# Altium project HV Interface.PrjPcb (part 1 of 2)
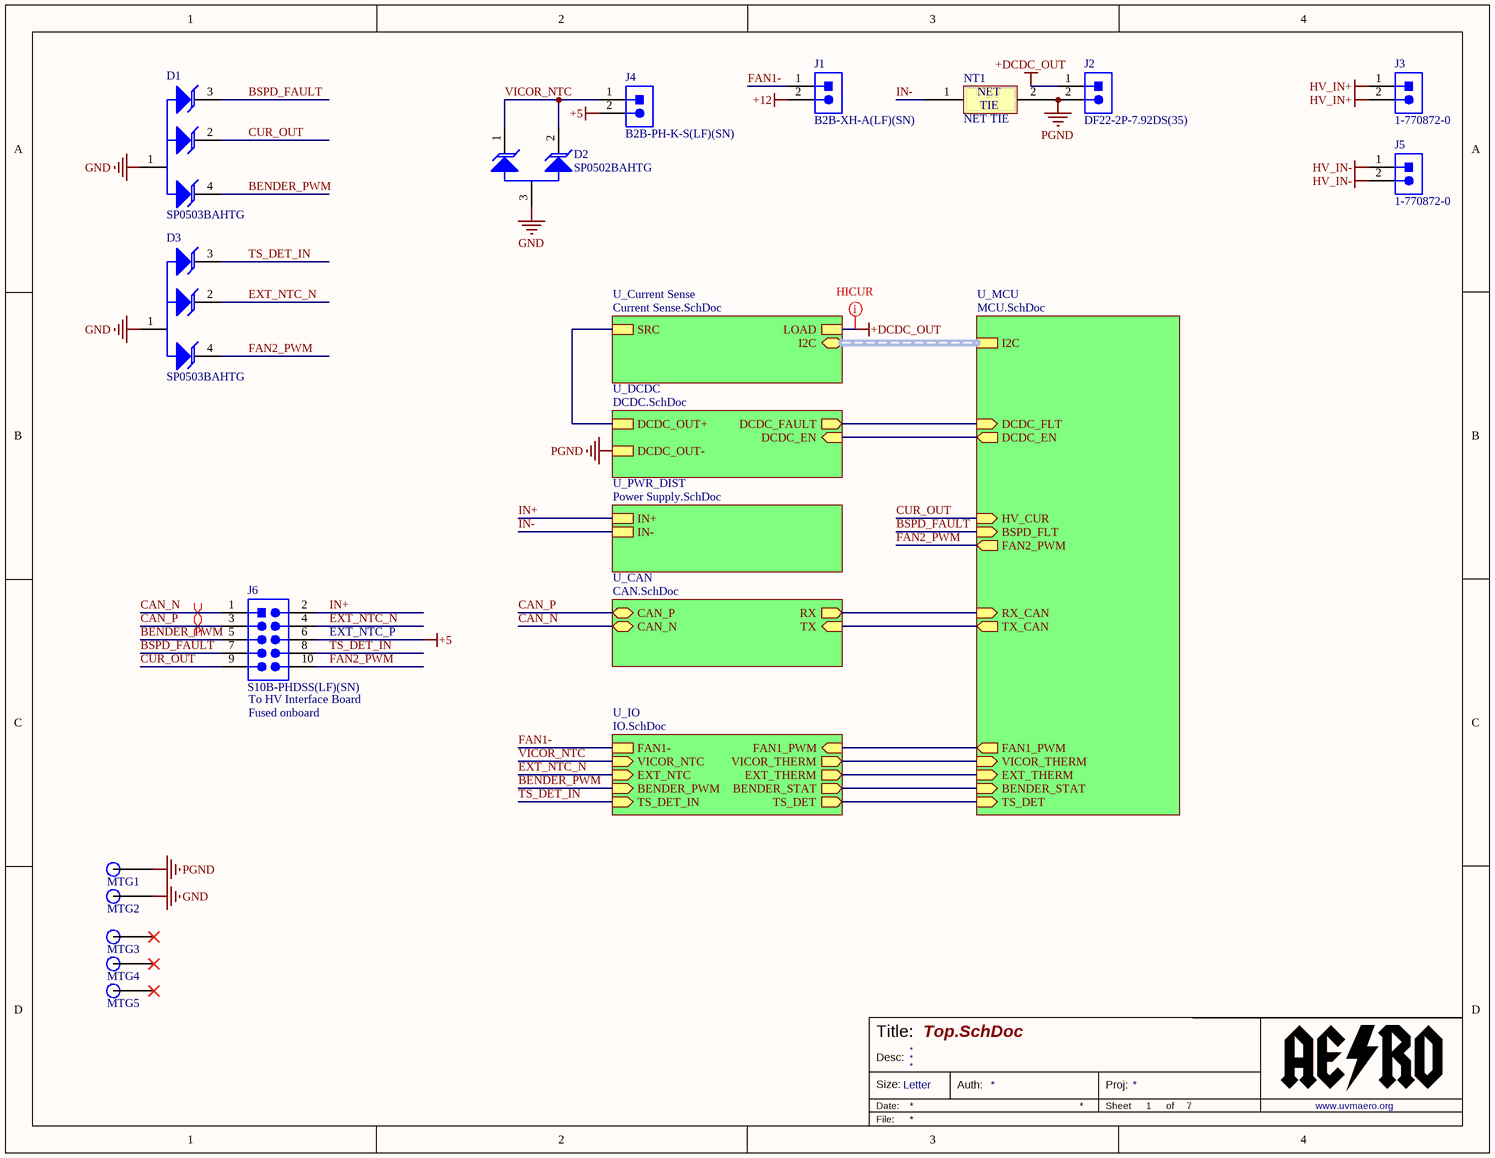
[diagram p0: Top.SchDoc]
ProjAuth: Andrew Katz; ProjName: CS4.5 HV Interface
7 sheets, 141 parts. Net scope: hierarchical (ports join the sheet entries above them; power ports are global).
Board file: HV Interface.PcbDoc
Sheets:
  Top.SchDoc
    U_DCDC = DCDC.SchDoc
    U_CAN = CAN.SchDoc
    U_MCU = MCU.SchDoc
    U_PWR_DIST = Power Supply.SchDoc
    U_IO = IO.SchDoc
    U_Current Sense = Current Sense.SchDoc

## Sheet Top.SchDoc
size Letter; DocumentNumber: 1; SheetNumber: 1; SheetTotal: 7

### Parts
D1  SP0503BAHTG  [Littelfuse_SP0503BAHTG_0]
D2  SP0502BAHTG  [TO-236 SOT23]
D3  SP0503BAHTG  [Littelfuse_SP0503BAHTG_0]
J1  B2B-XH-A(LF)(SN)  [B2B-XH-A(LF)(SN)]
J2  DF22-2P-7.92DS(35)  [CON2-1X2_RZ_DF22]
J3  1-770872-0  [CON2_1X2_P163_VM]
J4  B2B-PH-K-S(LF)(SN)  [JST_Sales_America_Inc._B2B-PH-K-S_LF_SN_0]
J5  1-770872-0  [CON2_1X2_P163_VM]
J6  S10B-PHDSS(LF)(SN)  [S10B-PHDSS]
MTG1  PCB MTG M3  [MTG-M3]  (value not drawn)  (no BOM)
MTG2  PCB MTG M3  [MTG-M3]  (value not drawn)  (no BOM)
MTG3  PCB MTG M3 HV  [MTG-M3-HV]  (value not drawn)  (no BOM)
MTG4  PCB MTG M3 HV  [MTG-M3-HV]  (value not drawn)  (no BOM)
MTG5  PCB MTG M3 HV  [MTG-M3-HV]  (value not drawn)  (no BOM)
NT1  NET TIE  [60MIL_TIE]  (net tie, no BOM)

### Sub-sheets
U_CAN = CAN.SchDoc: CAN_P (bidir), CAN_N (bidir), RX (out), TX (in)
U_Current Sense = Current Sense.SchDoc: I2C (bidir, harness I2C), SRC, LOAD
U_DCDC = DCDC.SchDoc: DCDC_FAULT (out), DCDC_EN (in), DCDC_OUT+, DCDC_OUT-
U_IO = IO.SchDoc: VICOR_THERM (out), EXT_THERM (out), FAN1-, FAN1_PWM (in), BENDER_PWM (in), BENDER_STAT (out), VICOR_NTC (in), EXT_NTC (in), TS_DET (out), TS_DET_IN (in)
U_MCU = MCU.SchDoc: I2C (harness I2C), HV_CUR (in), VICOR_THERM (in), DCDC_EN (out), EXT_THERM (in), FAN2_PWM (out), FAN1_PWM (out), RX_CAN (in), TX_CAN (out), DCDC_FLT (in), BSPD_FLT (in), BENDER_STAT (in), TS_DET (in)
U_PWR_DIST = Power Supply.SchDoc: IN+, IN-

### Nets
+5: J4.2 J6.6
+12: J1.2
+DCDC_OUT: J2.1 ; sheet U_Current Sense/LOAD
GND: D1.1 D2.3 D3.1 MTG2.1
HV_IN+: J3.1 J3.2
HV_IN-: J5.1 J5.2
PGND: J2.2 MTG1.1 NT1.2 ; sheet U_DCDC/DCDC_OUT-
BENDER_PWM: D1.4 J6.5 ; sheet U_IO/BENDER_PWM
BENDER_STAT: sheet U_MCU/BENDER_STAT, sheet U_IO/BENDER_STAT
BSPD_FAULT: D1.3 J6.7 ; sheet U_MCU/BSPD_FLT
CAN_N: J6.1 ; sheet U_CAN/CAN_N
CAN_P: J6.3 ; sheet U_CAN/CAN_P
CUR_OUT: D1.2 J6.9 ; sheet U_MCU/HV_CUR
DCDC_EN: sheet U_DCDC/DCDC_EN, sheet U_MCU/DCDC_EN
DCDC_FLT: sheet U_DCDC/DCDC_FAULT, sheet U_MCU/DCDC_FLT
DCDC_OUT+: sheet U_DCDC/DCDC_OUT+, sheet U_Current Sense/SRC
EXT_NTC_N: D3.2 J6.4 ; sheet U_MCU/EXT_THERM, sheet U_IO/EXT_THERM, sheet U_IO/EXT_NTC
FAN1-: J1.1 ; sheet U_IO/FAN1-
FAN1_PWM: sheet U_MCU/FAN1_PWM, sheet U_IO/FAN1_PWM
FAN2_PWM: D3.4 J6.10 ; sheet U_MCU/FAN2_PWM
IN+: J6.2 ; sheet U_PWR_DIST/IN+
IN-: NT1.1 ; sheet U_PWR_DIST/IN-
RX: sheet U_CAN/RX, sheet U_MCU/RX_CAN
TS_DET: sheet U_MCU/TS_DET, sheet U_IO/TS_DET
TS_DET_IN: D3.3 J6.8 ; sheet U_IO/TS_DET_IN
TX: sheet U_CAN/TX, sheet U_MCU/TX_CAN
VICOR_NTC: D2.1 D2.2 J4.1 ; sheet U_MCU/VICOR_THERM, sheet U_IO/VICOR_THERM, sheet U_IO/VICOR_NTC

Not connected (* = marked no-connect by the designer): MTG3 1*; MTG4 1*; MTG5 1*

### Buses and harness runs
harness sheet U_Current Sense/I2C = sheet U_MCU/I2C

### Layout directives
differential pair; differential pair class CAN: CAN_N, CAN_P
net class HICUR: +DCDC_OUT

### Notes on the sheet
- (near J6) EXT_NTC_P
- (near J6) To HV Interface Board
- (near J6) Fused onboard
- Title:
- Size:
- Date:
- Desc:
- Letter
- Auth:
- Sheet
- Proj:
- *
- of
- www.uvmaero.org
- File:
- (in symbol NET TIE) NET; TIE

### Library data of the parts
D1 D3 = SP0503BAHTG: 8.5V Clamp  Ipp Tvs Diode Surface Mount SOT-23-5 5.5V; Manufacturer: Littelfuse; Capacitance: 30pF; Diode Type: Avalanche; Direction: Unidirectional; Element Configuration: Common Anode; ESD Protection: Yes; Leakage Current: 100nA; Max Power Dissipation: 225mW; Number of Channels: 3; Polarity: Bidirectional,Unidirectional; Power Line Protection: No; Voltage Rating (DC): 5V; Breakdown Voltage: 5.5V; Case/Package: SOT-143; Category: Diodes; Clamping Voltage: 8.5V; Composition: Zener; Depth: 1.4mm; Height: 1.05mm; Lead Free: Lead Free; Length: 3.04mm; Manufacturer Part Number: SP0503BAHTG; Max Operating Temperature: 85°C; Max Reverse Leakage Current: 100nA; Min Operating Temperature: -40°C; Mount: Surface Mount; Number of Elements: 3; Number of Pins: 4; Number of Unidirectional Channels: 3; Operating Supply Voltage: 5.5V; Packaging: Tape and Reel; Peak Pulse Power: 225mW; Power Dissipation: 225mW; Radiation Hardening: No; REACH SVHC: No SVHC; Reverse Standoff Voltage: 5.5V; Termination: SMD/SMT; Width: 1.4mm; Working Voltage: 5.5V; Supplier 1: Digi-Key; Supplier Part Number 1: F3157DKR-ND
D2 = SP0502BAHTG: 8.5V Clamp  Ipp Tvs Diode Surface Mount SOT-23-5 5.5V; Manufacturer: Littelfuse; Capacitance: 30pF; Diode Type: Avalanche; Direction: Unidirectional; Element Configuration: Common Anode; ESD Protection: Yes; Leakage Current: 100nA; Max Power Dissipation: 225mW; Number of Channels: 2; Operating Supply Voltage: 5V; Polarity: Bidirectional,Unidirectional; Power Line Protection: No; Working Voltage: 5.5V; Breakdown Voltage: 5.5V; Case/Package: SOT-23-3; Category: Diodes; Clamping Voltage: 8.5V; Composition: Zener; Depth: 1.35mm; Height: 1.12mm; Lead Free: Lead Free; Length: 3.04mm; Manufacturer Part Number: SP0502BAHTG; Max Operating Temperature: 85°C; Max Reverse Leakage Current: 100nA; Min Operating Temperature: -40°C; Mount: Surface Mount; Number of Elements: 2; Number of Pins: 3; Number of Unidirectional Channels: 2; Packaging: Tape and Reel; Peak Pulse Power: 225mW; Power Dissipation: 225mW; Radiation Hardening: No; REACH SVHC: No SVHC; Reverse Standoff Voltage: 5.5V; Termination: SMD/SMT; Voltage Rating (DC): 5V; Width: 1.4mm; Supplier 1: Digi-Key; Supplier Part Number 1: F2714CT-ND
J1 = B2B-XH-A(LF)(SN): CONN HEADER VERT 2POS 2.5MM; Manufacturer: JST; Connector Type: Male Pin; Contact Resistance: 20mR; Current Rating: 3A; Insulation Resistance: 1GR; Max Voltage Rating (AC): 250V; Number of Contacts: 2; Wire/Cable Gauge: 22AWG; Category: FFC / FPC; Color: Natural; Contact Material: Brass; Contact Plating: Tin,Copper,Lead; Depth: 5.75mm; Fastening Type: Detent; Housing Color: White; Housing Material: Polyamide; Lead Free: Lead Free; Lead Pitch: 2.5mm; Length: 7.4mm; Manufacturer Part Number: B2B-XH-A(LF)(SN); Max Current Rating: 3A; Max Operating Temperature: 85°C; Max Voltage Rating (DC): 250V; Min Operating Temperature: -25°C; Mount: Through Hole; Number of Positions: 2; Number of Rows: 1; Orientation: Straight; Packaging: Bulk; Pitch: 2.5mm; REACH SVHC: No SVHC; Termination: Solder; Voltage Rating: 250V; Voltage Rating (AC): 250V; Supplier 1: Newark; Supplier Part Number 1: 73M9415
J2 = DF22-2P-7.92DS(35): Connector Header Through Hole, Right Angle 2 position 0.312" (7.92mm); Manufacturer: Hirose; Connector Type: Male Pin; Number of Positions: 2; Pitch: 0.312inch; Category: Connectors; Contact Mating Length: 0.354inch; Contact Plating: Tin; Fastening Type: Latch; Manufacturer Part Number: DF22-2P-7.92DS(35); Mount: Through Hole; Number of Pins: 2; Number of Rows: 1; Packaging: Bulk; Termination: Solder; Supplier 1: Digi-Key; Supplier Part Number 1: H125155-ND
J3 J5 = 1-770872-0: Connector Header Through Hole 2 position 0.163" (4.14mm); Vendor: TE Connectivity; Built_By: EMA_UL_Team; Approvals: CSA; Circuit Application: Power; Connector System: Wire-to-Board; Connector Type: Pin; Contact Current Rating: 9.5A; Contact Retention: No (Without); Gender: Male; Mating Alignment: Yes (With); Max Voltage Rating (AC): 600V; Number of Circuits: 2; Number of Ports: 1; PCB Mount Retention: With; PCB Mounting Orientation: Vertical; PCB Thickness: 0.062mm; Pitch: 0.162inch; Plating Thickness: 150um; VDE Tested: Yes; Manufacturer_Part_Number: 1-770872-0; Copyright: Copyright (C) 2018 Accelerated Designs. All rights reserved; RefDes: RefDes; Type: DEV; Value: Value; Supplier 1: Digi-Key; Supplier Part Number 1: A32449-ND; Category: Connectors; Color: White; Contact Gender: Male; Contact Material: Brass; Contact Plating: Tin; Current Rating: 9.5A; Depth: 6.35mm; ELV: Compliant; Fastening Type: Ramp; Flammability Rating: UL94 V-0; Height: 13.49mm; Housing Color: White; Housing Material: Nylon; Lead Free: Lead Free; Length: 9.83mm; Manufacturer: TE Connectivity; Manufacturer Part Number: 1-770872-0; Mating Retention: Yes (With); Max Operating Temperature: 221°C; Min Operating Temperature: -67°C; Mount: Through Hole; Number of Contacts: 2; Number of Positions: 2; Number of Power Positions: 2; Number of Rows: 1; Number of Terminals: 2; Orientation: Straight; Package Quantity: 200; Packaging: Bag; PCB Mount Alignment: No (Without); Radiation Hardening: No; REACH SVHC: Unknown; Sealable: No (Without); Strain Relief: No (Without); Termination: Solder; Voltage Rating: 600V; Width: 9.83mm
J4 = B2B-PH-K-S(LF)(SN): Connector Header Through Hole 2 position 0.079" (2.00mm); Manufacturer: JST; Manufacturer Part Number: B2BPHKSLFSN; Connector Type: Male Pin; Contact Resistance: 20mR; Current Rating: 2A; Gender: Male; Insulation Resistance: 1MR; Max Voltage Rating (AC): 100V; Number of Contacts: 2; Pitch: 2mm; Category: Connectors; Color: Natural; Contact Material: Brass,Tin; Contact Mating Length: 0.13inch; Contact Plating: Tin,Copper; Depth: 4.5mm; Fastening Type: Detent; Height: 9.4mm; Housing Color: White; Housing Material: Polyamide; Lead Free: Lead Free; Lead Pitch: 2mm; Length: 5.9mm; Max Current Rating: 2A; Max Operating Temperature: 85°C; Max Voltage Rating (DC): 100V; Min Operating Temperature: -25°C; Mount: Through Hole; Number of Pins: 2; Number of Poles: 2; Number of Positions: 2; Number of Rows: 1; Orientation: Straight; Packaging: Bulk; REACH SVHC: No SVHC; Termination: Solder; Voltage Rating: 100V; Voltage Rating (AC): 100V; Width: 4.5mm; Working Voltage: 100V; Supplier 1: Newark; Supplier 2: Digi-Key; Supplier Part Number 1: 37K9940; Supplier Part Number 2: 455-1704-ND
J6 = S10B-PHDSS(LF)(SN): Connector Header Through Hole, Right Angle 10 position 0.079" (2.00mm); Manufacturer: JST; Connector Type: Male Pin; Contact Resistance: 20mR; Current Rating: 3A; Gender: Male; Max Voltage Rating (AC): 250V; Number of Contacts: 10; Pitch: 2mm; Row Spacing: 0.079inch; Category: Headers and Wire Housings; Color: Natural; Contact Material: Copper Alloy,Tin; Contact Mating Length: 0.114inch; Contact Plating: Tin,Copper; Depth: 9.5mm; Fastening Type: Detent; Height: 9.5mm; Housing Color: Beige; Housing Material: Polyamide; Lead Free: Lead Free; Length: 11.9mm; Manufacturer Part Number: S10B-PHDSS(LF)(SN); Max Current Rating: 3A; Max Operating Temperature: 85°C; Min Operating Temperature: -25°C; Mount: Through Hole; Number of Positions: 10; Number of Rows: 2; Orientation: Right Angle; Packaging: Bulk; Termination: Solder; Width: 5mm; Supplier 1: Digi-Key; Supplier Part Number 1: 455-1775-ND
MTG1 MTG2 = MTG M3: PCB Mounting for M3 Screw; P/N: MTG M3; PCB Package: M3
MTG3-MTG5 = MTG M3 HV: PCB Mounting for M3 Screw - HV; P/N: MTG M3 HV; PCB Package: M3
NT1 = NET TIE: Net Tie (No BOM); ClassName: NET_TIE

## Sheet DCDC.SchDoc
size Letter; DocumentNumber: 2; SheetNumber: 2; SheetTotal: 7; DescLong2_DescShort: -
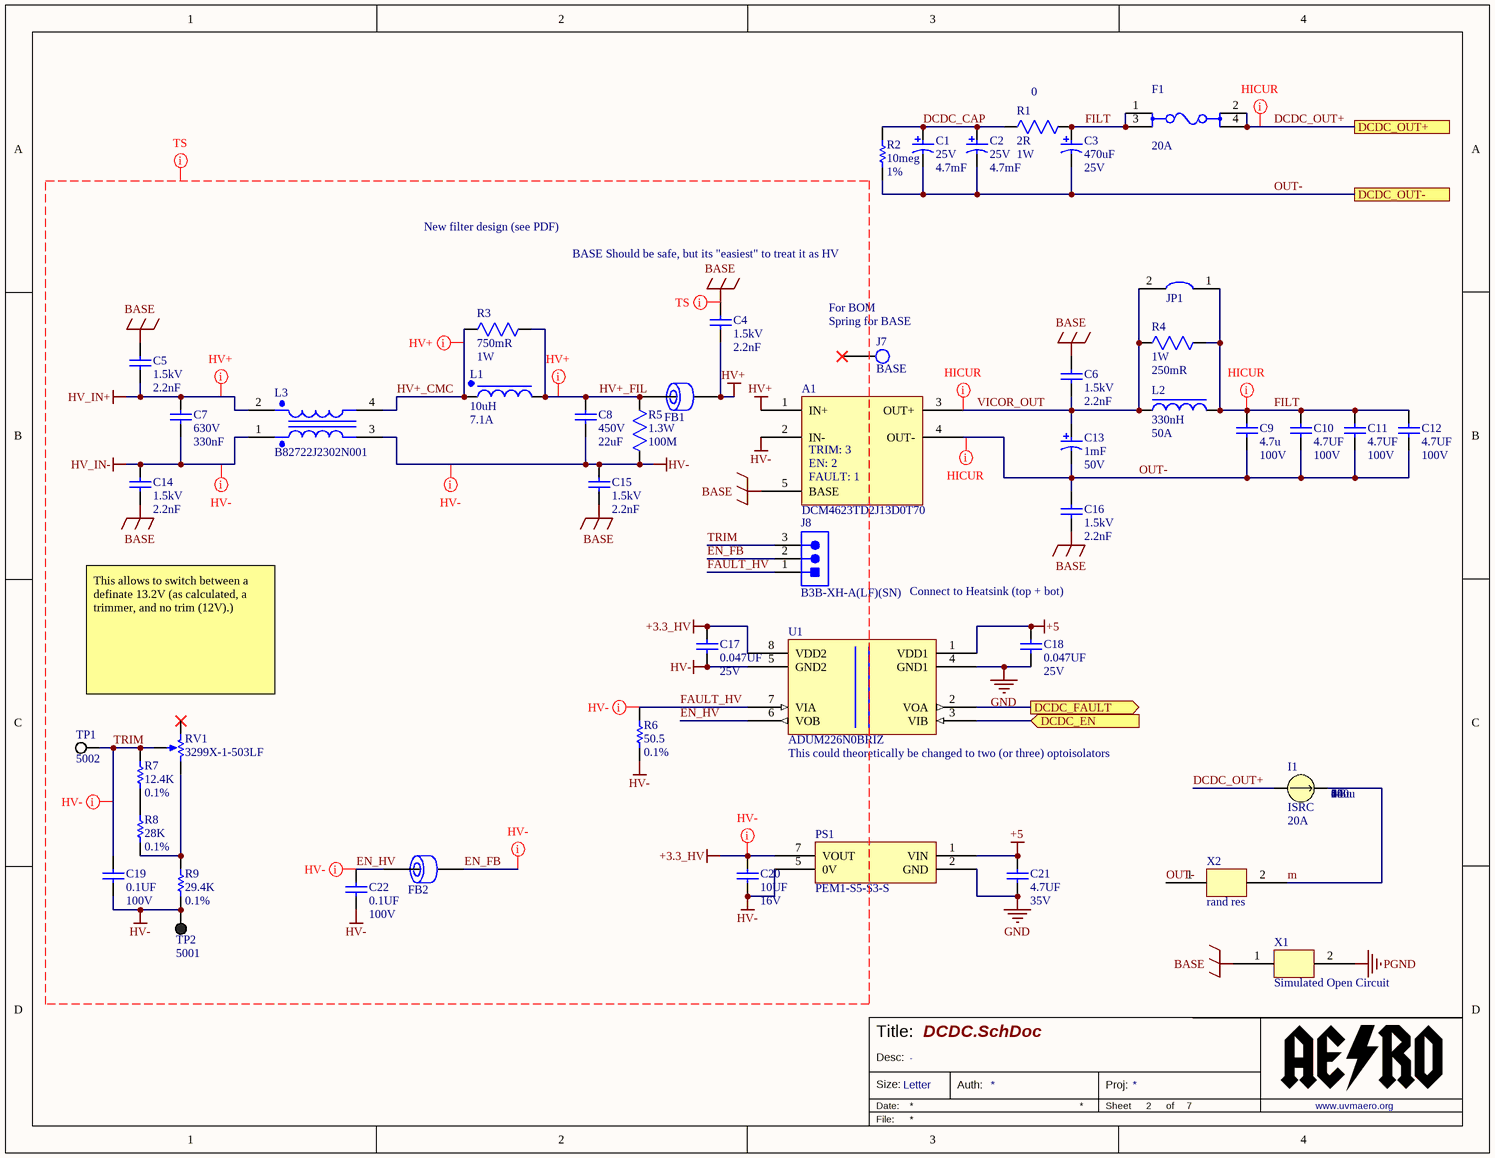
[diagram p1: DCDC.SchDoc]

### Parts
A1  VicorPN: DCM4623TD2J13D0T70  [VICOR_SOCKET_BUILT]  (hidden comment: VicorASM)
C1  Voltage Rating (DC): 25V  Capacitance: 4.7mF  [NICH_18X25]  (hidden comment: URS1E472MHD)
C2  Voltage Rating (DC): 25V  Capacitance: 4.7mF  [NICH_18X25]  (hidden comment: URS1E472MHD)
C3  Capacitance: 470uF  Voltage Rating (DC): 25V  [NICHICON_10X12.5]  (hidden comment: UVR1E471MPD1TD)
C4  Voltage Rating (DC): 1.5kV  Capacitance: 2.2nF  [B32021A3222K000]  (hidden comment: B32021A3222K000)
C5  Voltage Rating (DC): 1.5kV  Capacitance: 2.2nF  [B32021A3222K000]  (hidden comment: B32021A3222K000)
C6  Voltage Rating (DC): 1.5kV  Capacitance: 2.2nF  [B32021A3222K000]  (hidden comment: B32021A3222K000)
C7  Voltage: 630V  Capacitance: 330nF  [B32922C3334M000]  (hidden comment: B32922C3334M000)
C8  Voltage: 450V  Capacitance: 22uF  [B32774D]  (hidden comment: B32774D4226K000)
C9  Val: 4.7u  Vol: 100V  [1210_CAP_115H]  (hidden comment: CAP 1210 4.7UF 100V 20% X7S)
C10  Val: 4.7UF  Vol: 100V  [1210_CAP_115H]  (hidden comment: CAP 1210 4.7UF 100V 20% X7S)
C11  Val: 4.7UF  Vol: 100V  [1210_CAP_115H]  (hidden comment: CAP 1210 4.7UF 100V 20% X7S)
C12  Val: 4.7UF  Vol: 100V  [1210_CAP_115H]  (hidden comment: CAP 1210 4.7UF 100V 20% X7S)
C13  Capacitance: 1mF  Voltage Rating: 50V  [Nichicon_18x20]  (hidden comment: UHE1H102MHD3)
C14  Voltage Rating (DC): 1.5kV  Capacitance: 2.2nF  [B32021A3222K000]  (hidden comment: B32021A3222K000)
C15  Voltage Rating (DC): 1.5kV  Capacitance: 2.2nF  [B32021A3222K000]  (hidden comment: B32021A3222K000)
C16  Voltage Rating (DC): 1.5kV  Capacitance: 2.2nF  [B32021A3222K000]  (hidden comment: B32021A3222K000)
C17  Val: 0.047UF  Vol: 25V  [0603_CAP]  (hidden comment: CAP 0603 0.047UF 25V 10% X7R)
C18  Val: 0.047UF  Vol: 25V  [0603_CAP]  (hidden comment: CAP 0603 0.047UF 25V 10% X7R)
C19  Val: 0.1UF  Vol: 100V  [0805_CAP]  (hidden comment: CAP 0805 0.1UF 100V 10% X7R)
C20  Val: 10UF  Vol: 16V  [0603_CAP]  (hidden comment: CAP 0603 10UF 16V 20% X5R)
C21  Val: 4.7UF  Vol: 35V  [0603_CAP]  (hidden comment: CAP 0603 4.7UF 35V 10% X5R)
C22  Val: 0.1UF  Vol: 100V  [0805_CAP]  (hidden comment: CAP 0805 0.1UF 100V 10% X7R)
F1  FuseRating: 20A  [Keystone_3568_0]  (hidden comment: 3568)
FB1  FBMH4532HM681-T  [1812_FB]  (value not drawn)
FB2  Ferrite Chip 50 Ohms  [1206]  (value not drawn)
I1  ISRC  value 20A  AC Magnitude: 6  AC Phase: 15  DC Magnitude: 14  Pulsed Value: 20  Time Delay: 0  Rise Time: 6u  Fall Time: 0.3u  Pulse Width: 53u  Period: 100u  Phase: 4
J7  BASE  [KSTN240]  (mechanical)
J8  B3B-XH-A(LF)(SN)  [B3B-XH-A(LF)(SN)]
JP1  18AWG Link  [18AWG_1CM_LINK]  (value not drawn)
L1  Inductance: 10uH  Max DC Current: 7.1A  [WE-PD-XXL]  (hidden comment: 7447709100)
L2  Inductance: 330nH  Max DC Current: 50A  [WE-HCM 1390]  (hidden comment: 744309033)
L3  B82722J2302N001  [B82722J]
PS1  PEM1-S5-S3-S  [PEM1-S5-S3-S]
R1  value 0  Resistance: 2R  Power Rating: 1W  [RR01_VERT]  (hidden comment: RR01J2R0TB)
R2  Val: 10meg  Tol: 1%  [0603_RES]  (hidden comment: RES 0603 10M 1%)
R3  Resistance: 750mR  Power Rating: 1W  [RR01_VERT]  (hidden comment: RR01JR75TB)
R4  Power Rating: 1W  Resistance: 250mR  [WSLT2512]  (hidden comment: WSLT2512R2500FEB)
R5  value 100M  Power: 1.3W  [mur_MHR0422SA107F70]  (hidden comment: MHR0422SA107F70)
R6  Val: 50.5  Tol: 0.1%  [0805_RES]  (hidden comment: RES 0805 50.5 0.1%)
R7  Val: 12.4K  Tol: 0.1%  [0603_RES]  (hidden comment: RES 0603 12.4K 0.1%)
R8  Val: 28K  Tol: 0.1%  [0603_RES]  (hidden comment: RES 0603 28K 0.1%)
R9  Val: 29.4K  Tol: 0.1%  [0603_RES]  (hidden comment: RES 0603 29.4K 0.1%)
RV1  3299X-1-503LF  [3296Z]
TP1  5002  [KSTN-5002]
TP2  5001  [KSTN-5001]
U1  ADUM226N0BRIZ  [ADUM226N0BRIZ]
X1  Simulated Open Circuit
X2  rand res

### Ports
DCDC_EN (in), DCDC_FAULT (out), DCDC_OUT+, DCDC_OUT-

### Nets
+3.3_HV: C17.2 C20.2 PS1.7(VOUT) U1.8(VDD2)
+5: C18.2 C21.2 PS1.1(VIN) U1.1(VDD1)
BASE: A1.5(BASE) C4.2 C5.2 C6.2 C14.1 C15.1 C16.1 X1.1
GND: C18.1 C21.1 PS1.2(GND) U1.4(GND1)
HV+: A1.1(IN+) C4.1 FB1.2
HV-: A1.2(IN-) C8.1 C15.2 C17.1 C19.2 C20.1 C22.2 L3.3 PS1.5(0V) R5.1 R6.1 R9.1 TP2.1 U1.5(GND2)
HV_IN+: C5.1 C7.2 L3.2
HV_IN-: C7.1 C14.2 L3.1
PGND: A1.4(OUT-) C1.2 C2.2 C3.2 C9.1 C10.1 C11.1 C12.1 C13.2 C16.2 R2.1 X1.2 X2.1 ; port DCDC_OUT-  [also labelled OUT-]
DCDC_CAP: C1.1 C2.1 R1.2 R2.2
DCDC_EN: U1.3(VIB) ; port DCDC_EN
DCDC_FLT: U1.2(VOA) ; port DCDC_FAULT
DCDC_OUT+: F1.2 F1.4 I1.1 ; port DCDC_OUT+
EN_FB: FB2.2 J8.2
EN_HV: C22.1 FB2.1 U1.6(VOB)
FAULT_HV: J8.1 R6.2 U1.7(VIA)
FILT: C3.1 C9.2 C10.2 C11.2 C12.2 F1.1 F1.3 JP1.1 L2.2 R1.1 R4.2
HV+_CMC: L1.1 L3.4 R3.1
HV+_FIL: C8.2 FB1.1 L1.2 R3.2 R5.2
m: I1.2 X2.2
TRIM: C19.1 J8.3 R7.2 RV1.2(WIPER) TP1.1
VICOR_OUT: A1.3(OUT+) C6.1 C13.1 JP1.2 L2.1 R4.1
NetR7_1: R7.1 R8.2
NetR8_1: R8.1 R9.2 RV1.1(CCW)

Not connected (* = marked no-connect by the designer): J7 1*; RV1 3(CW)*

### Layout directives
net class TS_H: HV+_CMC, HV+_FIL, HV_IN+
net class TS_L: +3.3_HV, EN_FB, EN_HV, FAULT_HV, HV-, HV_IN-, TRIM
net class TS: +3.3_HV, BASE, EN_FB, EN_HV, FAULT_HV, HV+, HV+_CMC, HV+_FIL, HV-, HV_IN+, HV_IN-, TRIM
net class HICUR: DCDC_OUT+, FILT, PGND, VICOR_OUT

### Notes on the sheet
- New filter design (see PDF)
- BASE Should be safe, but its "easiest" to treat it as HV
- (near J7) For BOM
- (near J7) Spring for BASE
- Connect to Heatsink (top + bot)
- This allows to switch between a definate 13.2V (as calculated, a trimmer, and no trim (12V).)
- (near U1) This could theoretically be changed to two (or three) optoisolators
- Title:
- Size:
- Date:
- Desc:
- Letter
- Auth:
- Sheet
- Proj:
- *
- of
- www.uvmaero.org
- File:
- (in symbol VicorASM_ALT) TRIM: 3; EN: 2; FAULT: 1

### Library data of the parts
A1 = VicorASM_ALT: DCM4623TD2J13D0T70 PCB Assembly / Keystone 240 for BASE (also order KSTN241) / Do a full subassembly bom check; ComponentLink1Description: Datasheet; ComponentLink1URL: http://www.vicorpower.com/documents/datasheets/DCM4623xD2J13D0y7z_ds.pdf
C1 C2 = URS1E472MHD: 4700µF 25V Aluminum Electrolytic Capacitors Radial, Can  2000 Hrs @ 85°C; Manufacturer: Nichicon; Dielectric Material: Aluminium; Dissipation Factor: 0.16%; Leakage Current: 3.525mA; Life (Hours): 2000Hour; Ripple Current: 2.05A; Tolerance: 20%; Value: 0.0047; ComponentLink1Description: Manufacturer URL; ComponentLink2Description: Datasheet; ComponentLink2URL: http://products.nichicon.co.jp/en/pdf/XJA043/e-ud.pdf; ComponentLink3URL: http://products.nichicon.co.jp/en/pdf/XJA043/e-ud.pdf; ComponentLink3Description: Package Specification; ComponentLink1URL: http://www.nichicon.co.jp/; Case/Package: Radial; Category: Aluminum Electrolytic Capacitors; Diameter: 18mm; Height: 25mm; Height - Seated (Max): 1.043inch; Lead Free: Lead Free; Lead Pitch: 7.5mm; Length: 25mm; Manufacturer Part Number: URS1E472MHD; Max Operating Temperature: 85°C; Min Operating Temperature: -40°C; Mount: Through Hole; Number of Pins: 2; Package Quantity: 50; Packaging: Bulk; Radiation Hardening: No; REACH SVHC: No SVHC; Termination: Radial; Voltage Rating: 25V; Supplier 1: Digi-Key; Supplier Part Number 1: 493-15905-ND
C3 = UVR1E471MPD1TD: 470µF 25V Aluminum Electrolytic Capacitors Radial, Can  2000 Hrs @ 85°C; Manufacturer: Nichicon; Dissipation Factor: 0.16%; Lead Diameter: 0.6mm; Leakage Current: 352.5uA; Life (Hours): 2000Hour; Ripple Current: 550mA; Tolerance: 20%; ComponentLink1Description: Manufacturer URL; ComponentLink2Description: Datasheet; ComponentLink2URL: http://products.nichicon.co.jp/en/pdf/XJA043/e-ud.pdf; ComponentLink3URL: http://products.nichicon.co.jp/en/pdf/XJA043/e-ud.pdf; ComponentLink3Description: Package Specification; ComponentLink1URL: http://www.nichicon.co.jp/; Case/Package: Radial; Category: Aluminum Electrolytic Capacitors; Diameter: 10mm; Height: 12.5mm; Height - Seated (Max): 0.551inch; Lead Pitch: 5mm; Length: 12.5mm; Manufacturer Part Number: UVR1E471MPD1TD; Max Operating Temperature: 85°C; Min Operating Temperature: -40°C; Mount: Through Hole,PCB; Package Quantity: 500; Packaging: Tape and Reel; Radiation Hardening: No; REACH SVHC: No SVHC; Termination: Radial; Voltage: 25V; Voltage Rating: 25V; Supplier 1: Digi-Key; Supplier Part Number 1: UVR1E471MPD1TD-ND
C4-C6 C14-C16 = B32021A3222K000: 2200pF Film Capacitor 300V 1500V (1.5kV) Polypropylene (PP), Metallized Radial; Manufacturer: TDK EPCOS; Lead Diameter: 0.6mm; Lead/Base Style: Straight; Tolerance: 10%; ComponentLink1Description: Datasheet; ComponentLink1URL: http://en.tdk.eu/inf/20/20/db/fc_2009/Y2_B32021_026.pdf; Case/Package: Radial; Category: Film Capacitors; Depth: 4mm; Dielectric: PP; Height: 9mm; Lead Pitch: 10mm; Length: 13mm; Manufacturer Part Number: B32021A3222K000; Max Operating Temperature: 110°C; Min Operating Temperature: -40°C; Number of Pins: 2; Package Quantity: 1000; Packaging: Bulk; Termination: Radial; Voltage Rating (AC): 300V; Width: 4mm
C7 = B32922C3334M000: 0.33µF Film Capacitor 305V 630V Polypropylene (PP) Radial; Manufacturer: TDK EPCOS; Lead Diameter: 0.8mm; Tolerance: 20%; ComponentLink1Description: Datasheet; ComponentLink1URL: http://en.tdk.eu/inf/20/20/db/fc_2009/Y2_B32021_026.pdf; Supplier 1: Digi-Key; Case/Package: Radial; Category: Film Capacitors; Contact Plating: Tin,Matte; Depth: 8mm; Dielectric: PP; Dielectric Material: Polypropylene; Lead Pitch: 15mm; Length: 18mm; Manufacturer Part Number: B32922C3334M000; Max Operating Temperature: 105°C; Min Operating Temperature: -40°C; Mount: Through Hole; Number of Pins: 2; Packaging: Bulk; Radiation Hardening: No; REACH SVHC: No SVHC; Termination: Radial; Voltage Rating (AC): 305V; Width: 18mm; Supplier Part Number 1: 495-2321-ND
C8 = B32774D4226K000: 22µF Film Capacitor  450V Polypropylene (PP), Metallized Radial; Manufacturer: TDK EPCOS; ESR (Equivalent Series Resistance): 5.4mR; Lead Diameter: 0.8mm; Lead Length: 6mm; Tolerance: 10%; Category: Film Capacitors; Contact Plating: Tin,Matte; Depth: 22mm; Dielectric: PP; Dielectric Material: PP; Height: 36.5mm; Lead Pitch: 27.5mm; Length: 31.5mm; Manufacturer Part Number: B32774D4226K000; Max Operating Temperature: 105°C; Min Operating Temperature: -40°C; Mount: Through Hole; Packaging: Bulk; REACH SVHC: No SVHC; Termination: Radial; Voltage Rating: 450V; Voltage Rating (DC): 450V; Supplier 1: Digi-Key; Supplier Part Number 1: 495-3942-ND
C9 = CAP 1210 4.7UF 100V 20% X7S: Capacitor Surface Mount 1210 Footprint 4.7UF 100V 20% Tolerance Ceramic X7S; Manufacturer: Various; PCB Package: 1210; Description in Visual: Cap SMT 1210 4.7UF 100V 20%  Cer X7S; Value: 4.7u; P/N: CAP 1210 4.7UF 100V 20% X7S; Manufacturer P/N: Various; Voltage: 100V; Tolerance: 20%; Type: Ceramic X7S; ComponentLink1Description: Manufacturer Website; ComponentLink2Description: Component Datasheet; ComponentLink3Description: Octopart Link
C10-C12 = CAP 1210 4.7UF 100V 20% X7S: Capacitor Surface Mount 1210 Footprint 4.7UF 100V 20% Tolerance Ceramic X7S; Manufacturer: Various; PCB Package: 1210; Description in Visual: Cap SMT 1210 4.7UF 100V 20%  Cer X7S; P/N: CAP 1210 4.7UF 100V 20% X7S; Manufacturer P/N: Various; Value: 4.7UF; Voltage: 100V; Tolerance: 20%; Type: Ceramic X7S; ComponentLink1Description: Manufacturer Website; ComponentLink2Description: Component Datasheet; ComponentLink3Description: Octopart Link
C13 = UHE1H102MHD3: 1000µF 50V Aluminum Electrolytic Capacitors Radial, Can  10000 Hrs @ 105°C; Manufacturer: Nichicon; Dielectric Material: Aluminium; Dissipation Factor: 0.1%; ESR (Equivalent Series Resistance): 97mR; Impedance: 36mR; Lead Diameter: 0.8mm; Leakage Current: 500uA; Life (Hours): 10000Hour; Ripple Current: 2.49A; Tolerance: 20%; Value: 1m; Voltage Rating (DC): 50V; Case/Package: Radial; Category: Aluminum Electrolytic Capacitors; Diameter: 18mm; Height: 20mm; Height - Seated (Max): 0.787inch; Lead Free: Lead Free; Lead Pitch: 7.5mm; Length: 20mm; Manufacturer Part Number: UHE1H102MHD3; Max Operating Temperature: 105°C; Min Operating Temperature: -40°C; Mount: Through Hole; Package Quantity: 50; Packaging: Bulk; Radiation Hardening: No; REACH SVHC: No SVHC; Termination: Radial; Supplier 1: Digi-Key; Supplier Part Number 1: 493-1623-ND
C17 C18 = CAP 0603 0.047UF 25V 10% X7R: Capacitor Surface Mount 0603 Footprint 0.047UF 25V 10% Tolerance Ceramic X7R; Manufacturer: Various; PCB Package: 0603; Description in Visual: Cap SMT 0603 0.047UF 25V 10%  Cer X7R; P/N: CAP 0603 0.047UF 25V 10% X7R; Manufacturer P/N: Various; Value: 0.047UF; Voltage: 25V; Tolerance: 10%; Type: Ceramic X7R; ComponentLink1Description: Manufacturer Website; ComponentLink2Description: Component Datasheet; ComponentLink3Description: Octopart Link
C19 C22 = CAP 0805 0.1UF 100V 10% X7R: Capacitor Surface Mount 0805 Footprint 0.1UF 100V 10% Tolerance Ceramic X7R; Manufacturer: Various; PCB Package: 0805; Description in Visual: Cap SMT 0805 0.1UF 100V 10%  Cer X7R; P/N: CAP 0805 0.1UF 100V 10% X7R; Manufacturer P/N: Various; Value: 0.1UF; Voltage: 100V; Tolerance: 10%; Type: Ceramic X7R; ComponentLink1Description: Manufacturer Website; ComponentLink2Description: Component Datasheet; ComponentLink3Description: Octopart Link
C20 = CAP 0603 10UF 16V 20% X5R: Capacitor Surface Mount 0603 Footprint 10UF 16V 20% Tolerance Ceramic X5R; Manufacturer: Various; PCB Package: 0603; Description in Visual: Cap SMT 0603 10UF 16V 20% Ceramic X5R; P/N: CAP 0603 10UF 16V 20% X5R; Manufacturer P/N: Various; Value: 10UF; Voltage: 16V; Tolerance: 20%; Type: Ceramic X5R; ComponentLink1Description: Manufacturer Website; ComponentLink2Description: Component Datasheet; ComponentLink3Description: Octopart Link
C21 = CAP 0603 4.7UF 35V 10% X5R: Capacitor Surface Mount 0603 Footprint 47UF 35V 10% Tolerance Ceramic X5R; Manufacturer: Various; PCB Package: 0603; P/N: CAP 0603 4.7UF 35V 10% X5R; Manufacturer P/N: Various; Description in Visual: CAP 0603 4.7UF 35V 10% X5R; Value: 4.7UF; Voltage: 35V; Tolerance: 10%; Type: Ceramic X5R; ComponentLink1Description: Manufacturer Website; ComponentLink2Description: Component Datasheet; ComponentLink3Description: Octopart Link
F1 = 3568: Fuse Holder 30A 500V 1 Circuit Blade Through Hole; Manufacturer: Keystone Electronics; Approvals: UL; Body Material: Nylon; Color: Black; Fuse Type: Automotive; Illumination Type: Illuminated; Material: Brass,Tin,Nylon; Number of Circuits: 1; Value: 0.00321; Category: Fuse Holders; Contact Material: Brass,Tin; Contact Plating: Tin; Current Rating: 20A; Depth: 6.73mm; Flammability Rating: UL94 V-0; Fuse Current: 20A; Lead Free: Lead Free; Length: 16mm; Manufacturer Part Number: 3568; Max Operating Temperature: 145°C; Min Operating Temperature: -50°C; Mount: PCB,Vertical; Number of Poles: 1; Orientation: Vertical; Package Quantity: 1; REACH SVHC: No SVHC; Termination: PC Pin; Voltage: 500V; Voltage Rating (AC): 500V; Supplier 1: Digi-Key; Supplier Part Number 1: 36-3568-ND
FB1 = FBMH4532HM681-T: Ferrite Chip 4000 mA 680 Ohms Differential Mode - Single 1812 Footprint; Manufacturer: Taiyo Yuden; Description in Visual: Ferrite SMT 4000mA 680Ohm Dif Mode 1812; Usage: Power Supply; Current (mA): 5000; Frequency: 100 MHz; Impedance at Freq (ohms): 30; DC Resistance (ohms): 0.028; PCB Package: 1812; P/N: FBMH4532HM681-T; Manufacturer P/N: FBMH4532HM681-T; Filter type: Differential Mode - Single; Operating Temperature Range: -40 to +125 °C; ComponentLink1Description: Manufacturer Website; ComponentLink1URL: #http://www.yuden.co.jp#; ComponentLink2Description: Component Datasheet; ComponentLink2URL: #https://ds.yuden.co.jp/TYCOMPAS/ut/detail?pn=FBMH4532HM681-T%20%20&u=M#; ComponentLink3Description: Octopart Link; ComponentLink3URL: #https://octopart.com/search?q=FBMH4532HM681-T&currency=USD&specs=0#
FB2 = 742792114: Ferrite Chip 3000 mA 50 Ohms Differential Mode - Single 1206 Footprint; Manufacturer: Wurth Electronics; Description in Visual: Ferrite SMT 3000mA 50Ohm Dif Mode 1206; Usage: Power Supply; Current (mA): 3000; Frequency: 100 MHz; Impedance at Freq (ohms): 50; DC Resistance (ohms): 0.02; P/N: 742792114; Manufacturer P/N: 742792114; Filter type: Differential Mode - Single; Operating Temperature Range: -55 to +125 °C; PCB Package: 1206; ComponentLink1Description: Manufacturer Website; ComponentLink1URL: http://www.we-online.com; ComponentLink2Description: Component Datasheet; ComponentLink2URL: http://www.we-online.com/eisos/pdf/742792114.pdf; ComponentLink3Description: Octopart Link; ComponentLink3URL: http://octopart.com/partsearch/#search/requestData&q=742792114
I1 = ISRC: Current Source; Note: PCB Footprint - Not required; Published: 8-Jun-2000; LatestRevisionDate: 17-Jul-2002; LatestRevisionNote: Re-released for DXP Platform.; PackageReference: Not Applicable; Publisher: Altium Limited; Initial Value: 14
J7 = 240: Battery Contact Spring (Coil) AA 1 Cell PC Pin; Supplier 1: Digi-Key; Supplier Part Number 1: 36-240-ND
J8 = B3B-XH-A(LF)(SN): Connector Header Through Hole 3 position 0.098" (2.50mm); Manufacturer: JST; Wire/Cable Gauge: 22AWG; Connector Type: Male Pin; Contact Resistance: 20mR; Current Rating: 3A; Gender: Male; Insulation Resistance: 1GR; Max Voltage Rating (AC): 250V; Number of Contacts: 3; Pitch: 2.5mm; Category: Headers and Wire Housings; Color: Natural; Contact Material: Brass; Contact Plating: Tin,Lead,Copper; Depth: 5.75mm; Fastening Type: Detent; Housing Color: White; Housing Material: Polyamide; Lead Free: Lead Free; Lead Pitch: 2.5mm; Length: 9.9mm; Manufacturer Part Number: B3B-XH-A(LF)(SN); Max Current Rating: 3A; Max Operating Temperature: 85°C; Max Voltage Rating (DC): 250V; Min Operating Temperature: -25°C; Mount: Through Hole; Number of Positions: 3; Number of Rows: 1; Orientation: Straight; Packaging: Bulk; REACH SVHC: No SVHC; Termination: Press-Fit; Voltage Rating: 250V; Voltage Rating (AC): 250V; Supplier 1: Newark; Supplier Part Number 1: 73M9431
JP1 = JP_18AWG: 18AWG Jumper link, 1CM
L1 = 7447709100: 10µH Shielded Wirewound Inductor 7.1A 21mOhm Max Nonstandard; Manufacturer: Wurth Electronics; Core Material: Ferrite; DC Resistance (DCR): 21mR; Inductance Tolerance: 20%; Saturation Current: 10.5A; Self Resonant Frequency: 21MHz; Test Frequency: 1kHz; Case Code (Imperial): 1210; Case Code (Metric): 3225; Case/Package: Nonstandard; Category: Fixed Inductors; Composition: Wirewound; Current Rating: 7.1A; Depth: 12mm; Height: 10mm; Height - Seated (Max): 0.394inch; Lead Free: Lead Free; Lead Pitch: 7mm; Length: 12mm; Manufacturer Part Number: 7447709100; Max Operating Temperature: 125°C; Min Operating Temperature: -40°C; Mount: Surface Mount; Number of Pins: 2; Package Quantity: 250; Packaging: Cut Tape; REACH SVHC: Unknown; Resistance: 21mR; RMS Current (Irms): 7.1A; Series Resistance: 21mR; Shielding: Shielded; Termination: SMD/SMT; Tolerance: 20%; Weight: 0.01lb; Width: 12mm; Supplier 1: Digi-Key; Supplier Part Number 1: 732-1241-1-ND
L2 = 744309033: 330nH Shielded Wirewound Inductor 47.5A 0.165mOhm Nonstandard; Manufacturer: Wurth Electronics; Core Material: Zinc; DC Resistance (DCR): 0.165mR; Inductance Tolerance: 20%; Saturation Current: 62.5A; Self Resonant Frequency: 158MHz; Test Frequency: 100kHz; Width: 0.512inch; Case/Package: Nonstandard; Category: Fixed Inductors; Composition: Wirewound; Current Rating: 47.5A; Height: 9mm; Height - Seated (Max): 0.374inch; Lead Free: Lead Free; Length: 0.551inch; Manufacturer Part Number: 744309033; Max Operating Temperature: 125°C; Min Operating Temperature: -40°C; Mount: Surface Mount; Package Quantity: 300; Packaging: Tape and Reel; REACH SVHC: Unknown; RMS Current (Irms): 50A; Shielding: Shielded; Termination: SMD/SMT; Tolerance: 20%; Supplier 1: Allied Electronics; Supplier Part Number 1: 71071222
L3 = B82722J2302N001: 1.2mH @ 10kHz 2 Line Common Mode Choke Through Hole  3A DCR 56mOhm (Typ); Manufacturer: TDK EPCOS; Approvals: VDE,UR,ENEC; Core Material: Ferrite; DC Resistance (DCR): 56R; Inductance Tolerance: 30%; Lead/Base Style: Pin; Number of Lines: 2; Row Spacing: 12.5mm; Series Resistance: 56mR; Shielding: Unshielded; Voltage Rating (AC): 250V; Case/Package: Radial; Category: Common Mode Chokes; Contact Plating: Tin; Current Rating: 3A; DC Current: 3A; Depth: 16.1mm; Flammability Rating: UL94 V-0; Height: 25.4mm; Inductance: 1.2mH; Lead Free: Lead Free; Lead Pitch: 10mm; Length: 23.3mm; Manufacturer Part Number: B82722J2302N001; Max Current Rating: 3A; Max DC Current: 3A; Max Operating Temperature: 125°C; Military Standard: Not; Min Operating Temperature: -40°C; Mount: Through Hole; Number of Pins: 4; Package Quantity: 540; Packaging: Box; Radiation Hardening: No; REACH SVHC: No SVHC; Termination: Radial; Test Frequency: 10kHz; Tolerance: 30%; Weight: 0.35274oz; Width: 16.1mm; Supplier 1: Digi-Key; Supplier Part Number 1: 495-2748-ND
PS1 = PEM1-S5-S3-S: Isolated Module DC DC Converter 1 Output 3.3V    303mA 4.5V - 5.5V Input; Manufacturer: CUI; Efficiency: 75%; Isolation Voltage: 3kV; Max Power Dissipation: 1W; Number of Outputs: 1; Case/Package: SIP; Category: Board Mount Modules; Features: OVP,OCP,OTP,SCP; Height: 0.37inch; Lead Free: Lead Free; Length: 0.77inch; Manufacturer Part Number: PEM1-S5-S3-S; Max Input Voltage: 5.5V; Max Operating Temperature: 105°C; Max Output Current: 303mA; Min Input Voltage: 4.5V; Min Operating Temperature: -40°C; Mount: Through Hole; Packaging: Rail/Tube; Voltage - Output 1: 3.3V; Width: 0.24inch; Supplier 1: Digi-Key; Supplier Part Number 1: 102-3663-ND
R1 = RR01J2R0TB: 2 Ohms ±5% 1W Through Hole Resistor Axial Flame Retardant Coating, Pulse Withstanding, Safety Metal Film; Manufacturer: TE Connectivity Holsworthy; Manufacturer Part Number: RR01JR75TB; Voltage Rating: 350V; Number of Resistors: 1; Temperature Coefficient: 300ppm/°C; Case/Package: Axial; Category: Through-Hole Resistors; Composition: Power resistor; Diameter: 2.6mm; ELV: Compliant; Length: 6.8mm; Max Operating Temperature: 155°C; Min Operating Temperature: -55°C; Mount: Axial; Number of Terminations: 2; Package Quantity: 5000; Packaging: Ammo Pack; Termination: Axial; Tolerance: 5%; Supplier 1: Digi-Key; Supplier Part Number 1: A138161CT-ND
R2 = RES 0603 10M 1%: Resistor Surface Mount, 10M Ohms, 0603 Footprint, 1% Tolerance 0.1W; Manufacturer: Various; PCB Package: 0603; Description in Visual: Res SMT 10M 0603  1%  0.1W; Value: 10meg; P/N: RES 0603 10M 1%; Manufacturer P/N: Various; Power_Rating: 0.1W; Tolerance: 1%
R3 = RR01JR75TB: 750 mOhms ±5% 1W Through Hole Resistor Axial Flame Retardant Coating, Pulse Withstanding, Safety Metal Film; Manufacturer: TE Connectivity Holsworthy; Voltage Rating: 350V; Number of Resistors: 1; Temperature Coefficient: 300ppm/°C; Case/Package: Axial; Category: Through-Hole Resistors; Composition: Power resistor; Diameter: 2.6mm; ELV: Compliant; Length: 6.8mm; Manufacturer Part Number: RR01JR75TB; Max Operating Temperature: 155°C; Min Operating Temperature: -55°C; Mount: Axial; Number of Terminations: 2; Package Quantity: 5000; Packaging: Ammo Pack; Termination: Axial; Tolerance: 5%; Supplier 1: Digi-Key; Supplier Part Number 1: A138247CT-ND
R4 = WSLT2512R2500FEB: 250 mOhms ±1% 1W Chip Resistor 2512 (6432 Metric) Anti-Sulfur, Automotive AEC-Q200, Current Sense, Moisture Resistant, Pulse Withstanding Metal Element; Manufacturer: Vishay Dale; Temperature Coefficient: 75ppm/°C; Case Code (Imperial): 2512; Case Code (Metric): 6432; Case/Package: 2512; Category: Chip SMD Resistors; Composition: Metal Element; Features: Moisture Resistant; Height: 0.035inch; Length: 0.25inch; Manufacturer Part Number: WSLT2512R2500FEB; Max Operating Temperature: 275°C; Max Power Dissipation: 1W; Min Operating Temperature: -65°C; Number of Terminations: 2; Package Quantity: 1; Packaging: Tape and Reel; Termination: SMD/SMT; Tolerance: 1%; Weight: 0.001429oz; Width: 0.125inch; Supplier 1: Digi-Key; Supplier Part Number 1: WSLTB-.250CT-ND
R5 = MHR0422SA107F70: 100 MOhms ±1% 1.3W Through Hole Resistor Radial High Voltage Thick Film; Manufacturer: Murata; Manufacturer Part Number: MHR0422SA107F70; Supplier 1: Digi-Key; Supplier Part Number 1: 490-18226-ND
R6 = RES 0805 50.5 0.1%: Resistor Surface Mount, 50.5 Ohms, 0805 Footprint, 0.1% Tolerance 0.125W; Manufacturer: Various; PCB Package: 0805; Description in Visual: Res SMT 50.5 0805  0.1%  0.125W; Value: 50.5; P/N: RES 0805 50.5 0.1%; Manufacturer P/N: Various; Power_Rating: 0.125W; Tolerance: 0.1%
R7 = RES 0603 12.4K 0.1%: Resistor Surface Mount, 12.4K Ohms, 0603 Footprint, 0.1% Tolerance 0.1W; Manufacturer: Various; PCB Package: 0603; Description in Visual: Res SMT 12.4K 0603  0.1%  0.1W; P/N: RES 0603 12.4K 0.1%; Manufacturer P/N: Various; Value: 12.4K; Power_Rating: 0.1W; Tolerance: 0.1%
R8 = RES 0603 28K 0.1%: Resistor Surface Mount, 28K Ohms, 0603 Footprint, 0.1% Tolerance 0.1W; Manufacturer: Various; PCB Package: 0603; Description in Visual: Res SMT 28K 0603  0.1%  0.1W; P/N: RES 0603 28K 0.1%; Manufacturer P/N: Various; Value: 28K; Power_Rating: 0.1W; Tolerance: 0.1%
R9 = RES 0603 29.4K 0.1%: Resistor Surface Mount, 29.4K Ohms, 0603 Footprint, 0.1% Tolerance 0.1W; Manufacturer: Various; PCB Package: 0603; Description in Visual: Res SMT 29.4K 0603  0.1%  0.1W; P/N: RES 0603 29.4K 0.1%; Manufacturer P/N: Various; Value: 29.4K; Power_Rating: 0.1W; Tolerance: 0.1%
RV1 = 3299X-1-503LF: 50 kOhms 0.5W, 1/2W PC Pins Through Hole Trimmer Potentiometer Cermet 25 Turn Side Adjustment; Manufacturer: Bourns; Max Power Dissipation: 500mW; Number of Turns: 25; Resistance: 50kR; Temperature Coefficient: 100ppm/°C; Tolerance: 10%; Voltage Rating: 300V; Voltage Rating (DC): 500V; Category: Variable Resistors and Potentiometers; Color: Blue; Composition: Cermet; Depth: 6.1mm; Height: 0.375inch; Lead Free: Lead Free; Length: 11.05mm; Manufacturer Part Number: 3299X-1-503LF; Max Operating Temperature: 125°C; Military Standard: Not; Min Operating Temperature: -55°C; Mount: Panel,Through Hole,PCB; Package Quantity: 50; Packaging: Rail/Tube; Power Rating: 500mW; Radiation Hardening: No; REACH SVHC: No SVHC; Taper: Linear; Termination: Pin; Weight: 0.035oz; Width: 9.53mm; Supplier 1: Digi-Key; Supplier Part Number 1: 3299X-503LF-ND
TP1 = 5002: Test Point, White, 1-Pin THD, RoHS, Bulk; Manufacturer: KeystoneElectronics; Outside Diameter: 2.54mm; Plating: Silver; Mounting Hole Size: 1mm; Product: TestPoints; Packaging: Bulk; Manufacturer URL: http://www.keyelco.com/; Length: 7.62mm; Datasheet Version: Rev. G, 12/2008; Type: Miniature; Product Category: CircuitBoardHardware-PCB; Material: Nylon; RoHS: True; Contact Material: PhosphorBronze; Datasheet URL: https://ciiva.com/datasheet-click-2917627?src=ciiva&sig=bd195616; Color: White; Brand: KeystoneElectronics; Supplier 1: Digi-Key; Supplier Part Number 1: 36-5002-ND
TP2 = 5001: Test Point, Black, 1-Pin THD, RoHS, Bulk; Manufacturer: KeystoneElectronics; Outside Diameter: 2.54mm; Plating: Silver; Mounting Hole Size: 1mm; Product: TestPoints; Packaging: Bulk; Manufacturer URL: http://www.keyelco.com/; Length: 7.62mm; Datasheet Version: Rev. G, 12/2008; Type: Miniature; Product Category: CircuitBoardHardware-PCB; Material: Nylon; RoHS: True; Contact Material: PhosphorBronze; Datasheet URL: https://ciiva.com/datasheet-click-2917627?src=ciiva&sig=bd195616; Color: Black; Brand: KeystoneElectronics; Supplier 1: Digi-Key; Supplier Part Number 1: 36-5001-ND
U1 = ADUM226N0BRIZ: General Purpose Digital Isolator 5000Vrms 2 Channel 150Mbps 75kV/µs CMTI 8-SOIC (0.295", 7.50mm Width); Manufacturer: Analog Devices; Vendor: Analog Devices Inc; Built_By: Analog Devices Inc.; Max Supply Voltage: 5.5V; Min Supply Voltage: 1.7V; Number of Channels: 2; Propagation Delay: 7.2ns; Manufacturer_Part_Number: ADUM226N0BRIZ; Copyright: Copyright (C) 2018 Accelerated Designs. All rights reserved; RefDes: RefDes; Type: DEV; Value: Value; Case/Package: SOIC; Lead Free: Contains Lead; Manufacturer Part Number: ADUM226N0BRIZ; Max Operating Temperature: 125°C; Min Operating Temperature: -40°C; Number of Pins: 8; REACH SVHC: No SVHC
X1 X2 = Generic

## Sheet CAN.SchDoc
size Letter; DocumentNumber: 4; SheetNumber: 4; SheetTotal: 7
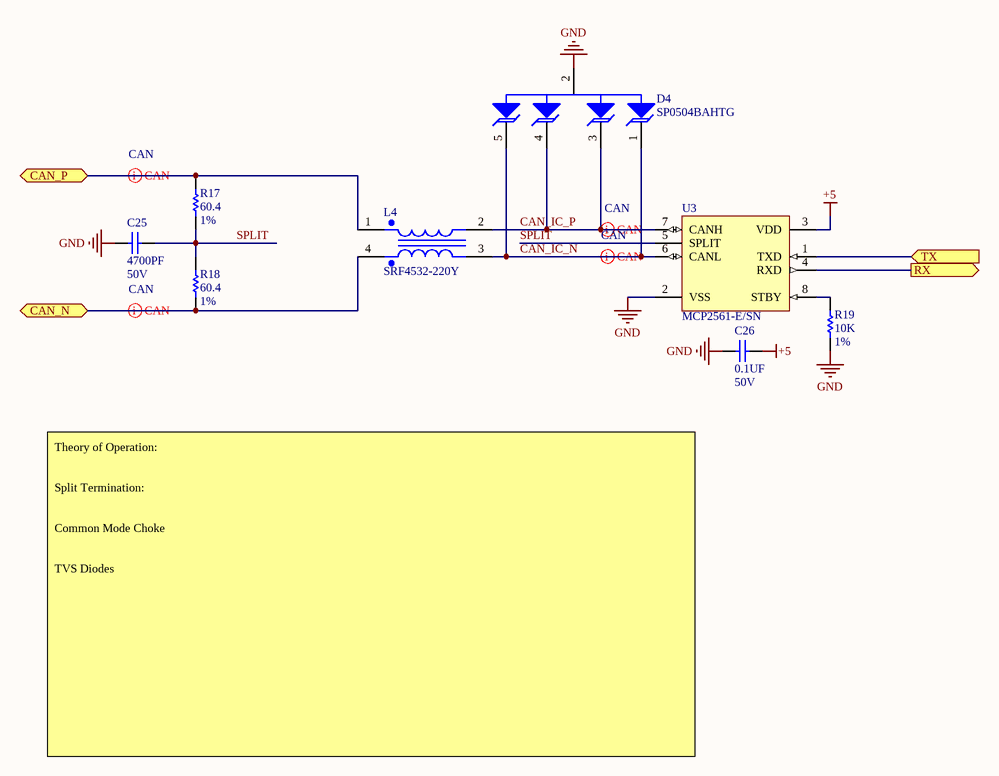
[diagram p2: CAN.SchDoc]

### Parts
C25  Val: 4700PF  Vol: 50V  [0603_CAP]  (hidden comment: CAP 0603 4700PF 50V 10% X7R)
C26  Val: 0.1UF  Vol: 50V  [0603_CAP]  (hidden comment: CAP 0603 0.1UF 50V 10% X7R)
D4  SP0504BAHTG  [SOT23127P600-8N]
L4  SRF4532-220Y  [IND_BOURNS_SRF45]
R17  Val: 60.4  Tol: 1%  [0805_RES]  (hidden comment: RES 0805 60.4 1%)
R18  Val: 60.4  Tol: 1%  [0805_RES]  (hidden comment: RES 0805 60.4 1%)
R19  Val: 10K  Tol: 1%  [0603_RES]  (hidden comment: RES 0603 10K 1%)
U3  MCP2561-E/SN  [Microchip_C04-2057A_0]

### Ports
CAN_N (bidir), CAN_P (bidir), RX (out), TX (in)

### Nets
+5: C26.2 U3.3(VDD)
GND: C25.1 C26.1 D4.2 R19.1 U3.2(VSS)
CAN_IC_N: D4.1 D4.5 L4.3 U3.6(CANL)
CAN_IC_P: D4.3 D4.4 L4.2 U3.7(CANH)
CAN_N: L4.4 R18.1 ; port CAN_N
CAN_P: L4.1 R17.2 ; port CAN_P
RX: U3.4(RXD) ; port RX
SPLIT: C25.2 R17.1 R18.2 U3.5(SPLIT)
TX: U3.1(TXD) ; port TX
NetR19_2: R19.2 U3.8(STBY)

### Layout directives
differential pair; differential pair class CAN: CAN_IC_N, CAN_IC_P, CAN_N, CAN_P

### Notes on the sheet
- Theory of Operation:
  Split Termination:
  Common Mode Choke
  TVS Diodes
- Title:
- Size:
- Date:
- Desc:
- Letter
- Auth:
- Sheet
- Proj:
- *
- of
- www.uvmaero.org
- File:

### Library data of the parts
C25 = CAP 0603 4700PF 50V 10% X7R: Capacitor Surface Mount 0603 Footprint 4700PF 50V 10% Tolerance Ceramic X7R; Manufacturer: Various; PCB Package: 0603; Description in Visual: Cap SMT 0603 4700PF 50V 10%  Cer X7R; P/N: CAP 0603 4700PF 50V 10% X7R; Manufacturer P/N: Various; Value: 4700PF; Voltage: 50V; Tolerance: 10%; Type: Ceramic X7R; ComponentLink1Description: Manufacturer Website; ComponentLink2Description: Component Datasheet; ComponentLink3Description: Octopart Link
C26 = CAP 0603 0.1UF 50V 10% X7R: Capacitor Surface Mount 0603 Footprint 0.1UF 50V 10% Tolerance Ceramic X7R; Manufacturer: Various; PCB Package: 0603; Description in Visual: Cap SMT 0603 0.1UF 50V 10%  Cer X7R; P/N: CAP 0603 0.1UF 50V 10% X7R; Manufacturer P/N: Various; Value: 0.1UF; Voltage: 50V; Tolerance: 10%; Type: Ceramic X7R; ComponentLink1Description: Manufacturer Website; ComponentLink2Description: Component Datasheet; ComponentLink3Description: Octopart Link
D4 = SP0504BAHTG: 8.5V Clamp  Ipp Tvs Diode Surface Mount SOT-23-5 5.5V; Manufacturer: Littelfuse; Capacitance: 30pF; Diode Type: Avalanche; Direction: Unidirectional; Element Configuration: Common Anode; ESD Protection: Yes; Leakage Current: 100nA; Max Power Dissipation: 225mW; Number of Channels: 4; Polarity: Bidirectional,Unidirectional; Power Line Protection: No; Voltage Rating (DC): 5V; Breakdown Voltage: 5.5V; Case/Package: SOT-23; Category: TVS Diodes; Clamping Voltage: 8.5V; Composition: Zener; Depth: 1.75mm; Height: 1.3mm; Lead Free: Lead Free; Length: 3.05mm; Manufacturer Part Number: SP0504BAHTG; Max Operating Temperature: 85°C; Max Reverse Leakage Current: 100nA; Min Operating Temperature: -40°C; Mount: Surface Mount; Number of Elements: 4; Number of Pins: 5; Number of Unidirectional Channels: 4; Packaging: Tape and Reel; Peak Pulse Power: 225mW; Power Dissipation: 225mW; Radiation Hardening: No; REACH SVHC: Unknown; Reverse Standoff Voltage: 5.5V; Termination: SMD/SMT; Width: 1.75mm; Working Voltage: 5.5V; Supplier 1: Digi-Key; Supplier Part Number 1: F3157CT-ND
L4 = SRF4532-220Y: 22µH @ 100kHz 2 Line Common Mode Choke Surface Mount 1 kOhms @ 10MHz 200mA DCR 2.65Ohm; Manufacturer: Bourns; Core Material: Ferrite; DC Resistance (DCR): 2.65R; Impedance: 1kR; Inductance: 22uH; Inductance Tolerance: -30%; Insulation Resistance: 10MR; Material: Steel; Number of Lines: 2; Tolerance: 50%; Case Code (Imperial): 1812; Case Code (Metric): 4532; Case/Package: 4532; Category: Fixed Inductors; Current: 200mA; Current Rating: 200mA; DC Current: 200mA; Depth: 3.4mm; Height: 0.118inch; Lead Free: Lead Free; Length: 4.5mm; Manufacturer Part Number: SRF4532-220Y; Max DC Current: 200mA; Max Operating Temperature: 125°C; Min Operating Temperature: -40°C; Mount: Surface Mount,PCB; Package Quantity: 1; Packaging: Tape and Reel; REACH SVHC: No SVHC; Resistance: 1kR; Self Resonant Frequency: 100kHz; Termination: SMD/SMT; Test Frequency: 100kHz; Width: 0.126inch
R17 R18 = RES 0805 60.4 1%: Resistor Surface Mount, 60.4 Ohms, 0805 Footprint, 1% Tolerance 0.125W; Manufacturer: Various; PCB Package: 0805; Description in Visual: Res SMT 60.4 0805  1%  0.125W; Value: 60.4; P/N: RES 0805 60.4 1%; Manufacturer P/N: Various; Power_Rating: 0.125W; Tolerance: 1%
R19 = RES 0603 10K 1%: Resistor Surface Mount, 10K Ohms, 0603 Footprint, 1% Tolerance 0.1W; Manufacturer: Various; PCB Package: 0603; Description in Visual: Res SMT 10K 0603  1%  0.1W; P/N: RES 0603 10K 1%; Manufacturer P/N: Various; Value: 10K; Power_Rating: 0.1W; Tolerance: 1%
U3 = MCP2561-E/SN: 1/1 Transceiver CANbus 8-SOIC; Manufacturer: Microchip; Voltage: 4.5V ~ 5.5V; Duplex: Full; Propagation Delay Time: 125 ns; Data Rate: 1 Mb/s; Mfg Package Ident: C04-2057A; Protocol: CAN; helpURL: https://upverter.com/upn/revision/7ae0784463458063/; ComponentLink2Description: Datasheet; Temperature: -40°C to +125°C; Package: C04-2057A; Supplier 2: Mouser; Supplier 1: Digi-Key; ComponentLink1URL: https://upverter.com/upn/revision/7ae0784463458063/; Supplier Part Number 2: 579-MCP2561-E/SN; Supplier Part Number 1: MCP2561-E/SN-ND; ComponentLink1Description: Upverter; ComponentLink2URL: https://upverter.com/datasheet/23625d8df5c60d1941db5c365e0a3694c4b69235.pdf; RoHS: TRUE; Mouser Part Number: 579-MCP2561-E/SN; Number of Drivers/Receivers: 1/1; Type: Transceiver; Temperature Range High: +125°C; Digikey Description: IC 1/1 Transceiver Full CAN 8-SOIC; Digikey Part Number: MCP2561-E/SN-ND; Lead Free: yes; Temperature Range Low: -40°C; Part Number: MCP2561-E/SN